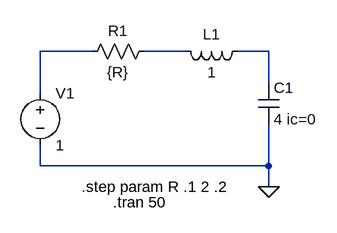
[diagram p0: schematic Draft1.asc]
Draft1.asc, the LTspice schematic file:
Version 4
SHEET 1 880 680
WIRE 240 224 160 224
WIRE 384 224 320 224
WIRE 512 224 464 224
WIRE 512 272 512 224
WIRE 160 288 160 224
WIRE 160 400 160 368
WIRE 512 400 512 336
WIRE 512 400 160 400
WIRE 512 432 512 400
FLAG 512 432 0
SYMBOL Voltage 160 272 R0
SYMATTR InstName V1
SYMATTR Value 1
SYMBOL Res 336 208 R90
WINDOW 0 0 56 VBottom 2
WINDOW 3 32 56 VTop 2
SYMATTR InstName R1
SYMATTR Value {R}
SYMBOL Cap 496 272 R0
SYMATTR InstName C1
SYMATTR Value 4 ic=0
SYMBOL Ind 480 208 R90
WINDOW 0 5 56 VBottom 2
WINDOW 3 32 56 VTop 2
SYMATTR InstName L1
SYMATTR Value 1
TEXT 224 432 Left 2 !.step param R .1 2 .2
TEXT 272 456 Left 2 !.tran 50

The netlist it stands for:
* Draft1.asc
V1 N001 0 1
R1 N002 N001 {R}
C1 N003 0 4 ic=0
L1 N003 N002 1
.step param R .1 2 .2
.tran 50
.backanno
.end